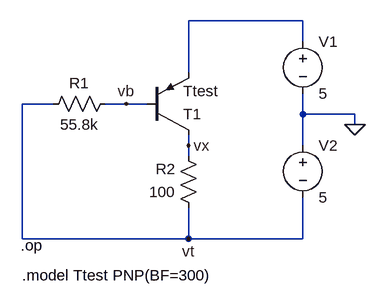
[diagram p0: schematic Draft1.asc]
Draft1.asc, the LTspice schematic file:
Version 4
SHEET 1 880 680
WIRE 384 48 208 48
WIRE 384 80 384 48
WIRE 208 128 208 48
WIRE 0 176 -48 176
WIRE 112 176 80 176
WIRE 144 176 112 176
WIRE 384 192 384 160
WIRE 464 192 384 192
WIRE 464 208 464 192
WIRE 208 240 208 224
WIRE 384 240 384 192
WIRE 208 256 208 240
WIRE -48 384 -48 176
WIRE 208 384 208 336
WIRE 208 384 -48 384
WIRE 384 384 384 320
WIRE 384 384 208 384
FLAG 464 208 0
FLAG 208 240 vx
FLAG 112 176 vb
FLAG 208 384 vt
SYMBOL pnp 144 224 M180
SYMATTR InstName T1
SYMATTR Value Ttest
SYMBOL res 96 160 R90
WINDOW 0 0 56 VBottom 2
WINDOW 3 32 56 VTop 2
SYMATTR InstName R1
SYMATTR Value 55.8k
SYMBOL res 224 352 R180
WINDOW 0 36 76 Left 2
WINDOW 3 36 40 Left 2
SYMATTR InstName R2
SYMATTR Value 100
SYMBOL voltage 384 64 R0
WINDOW 123 0 0 Left 0
WINDOW 39 0 0 Left 0
SYMATTR InstName V1
SYMATTR Value 5
SYMBOL voltage 384 224 R0
WINDOW 123 0 0 Left 0
WINDOW 39 0 0 Left 0
SYMATTR InstName V2
SYMATTR Value 5
TEXT -50 394 Left 2 !.op
TEXT -48 440 Left 2 !.model Ttest PNP(BF=300)

The netlist it stands for:
* Draft1.asc
Q§T1 vx vb N001 0 Ttest
R1 vb vt 55.8k
R2 vt vx 100
V1 N001 0 5
V2 0 vt 5
.model NPN NPN
.model PNP PNP
.lib standard.bjt
.op
.model Ttest PNP(BF=300)
.backanno
.end